# EAGLE schematic low-gain-radio (EAGLE 7.3.0)
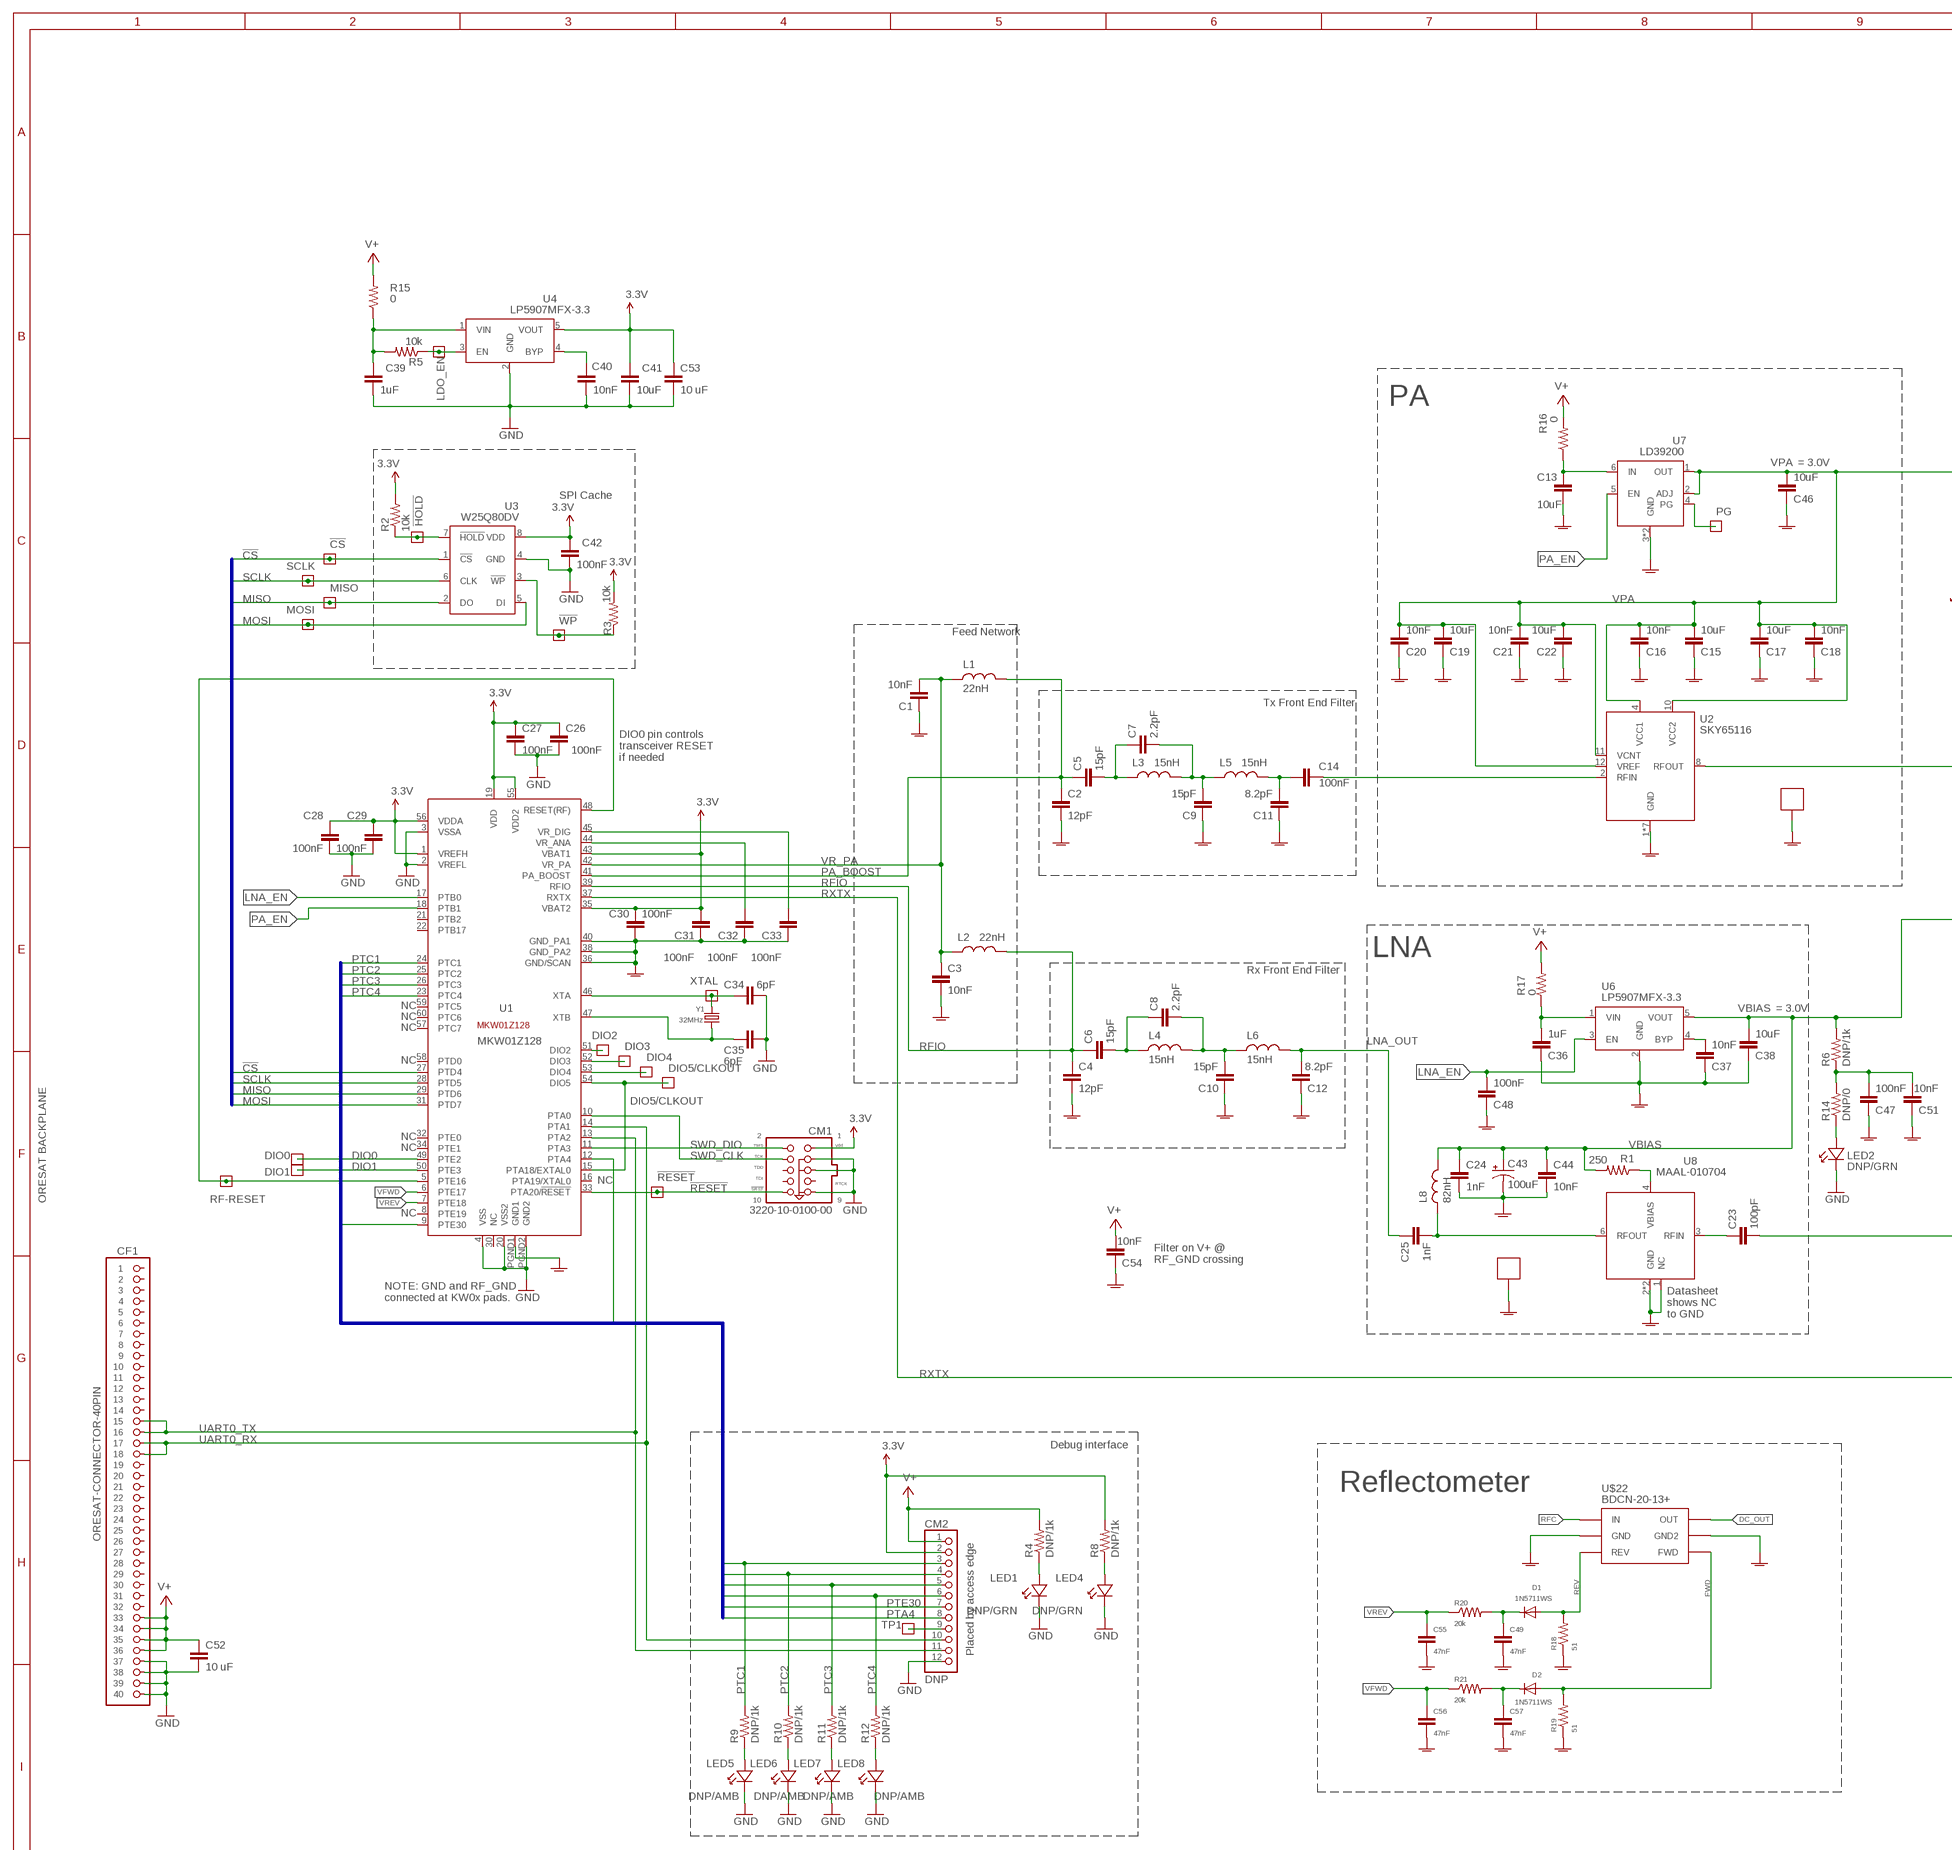
[diagram p0: schematic, sheet 1, part 1 of 2]
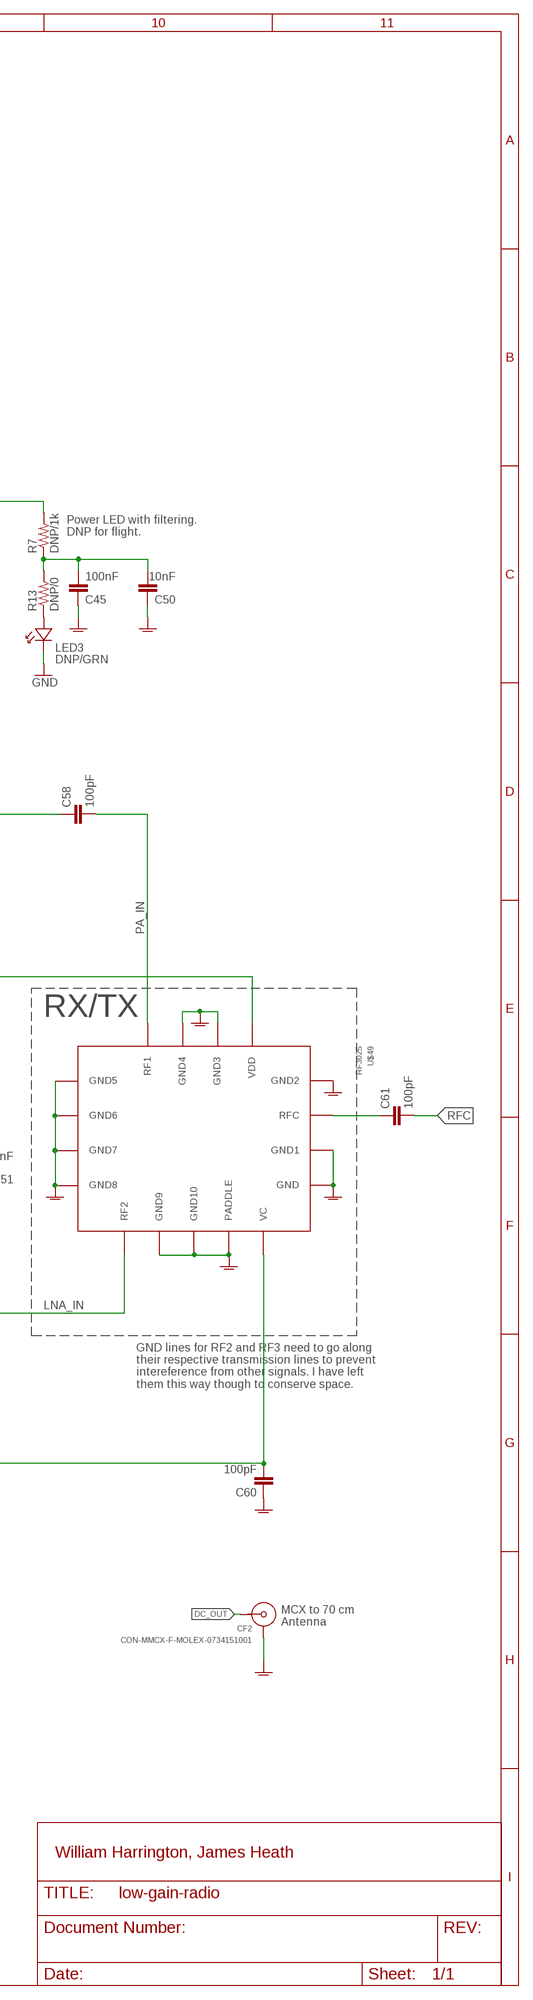
[diagram p1: schematic, sheet 1, part 2 of 2]

## Parts
!CS  TEST-POINT  [2MM-TEST-POINT]
!HOLD  TEST-POINT  [2MM-TEST-POINT]
!RESET  TEST-POINT  [2MM-TEST-POINT]
!WP  TEST-POINT  [2MM-TEST-POINT]
C1  10nF  C-EU0603-B-NOSILK  [.0603-B-NOSILK]
C2  12pF  C-EU0603-B-NOSILK  [.0603-B-NOSILK]
C3  10nF  C-EU0603-B-NOSILK  [.0603-B-NOSILK]
C4  12pF  C-EU0603-B-NOSILK  [.0603-B-NOSILK]
C5  15pF  C-EU0603-B-NOSILK  [.0603-B-NOSILK]
C6  15pF  C-EU0603-B-NOSILK  [.0603-B-NOSILK]
C7  2.2pF  C-EU0603-B-NOSILK  [.0603-B-NOSILK]
C8  2.2pF  C-EU0603-B-NOSILK  [.0603-B-NOSILK]
C9  15pF  C-EU0603-B-NOSILK  [.0603-B-NOSILK]
C10  15pF  C-EU0603-B-NOSILK  [.0603-B-NOSILK]
C11  8.2pF  C-EU0603-B-NOSILK  [.0603-B-NOSILK]
C12  8.2pF  C-EU0603-B-NOSILK  [.0603-B-NOSILK]
C13  10uF  C-EU0603-B-NOSILK  [.0603-B-NOSILK]
C14  100nF  C-EU0603-B-NOSILK  [.0603-B-NOSILK]
C15  10uF  C-EU0603-B-NOSILK  [.0603-B-NOSILK]
C16  10nF  C-EU0603-B-NOSILK  [.0603-B-NOSILK]
C17  10uF  C-EU0603-B-NOSILK  [.0603-B-NOSILK]
C18  10nF  C-EU0603-B-NOSILK  [.0603-B-NOSILK]
C19  10uF  C-EU0603-B-NOSILK  [.0603-B-NOSILK]
C20  10nF  C-EU0603-B-NOSILK  [.0603-B-NOSILK]
C21  10nF  C-EU0603-B-NOSILK  [.0603-B-NOSILK]
C22  10uF  C-EU0603-B-NOSILK  [.0603-B-NOSILK]
C23  100pF  C-EU0402-C-NOSILK  [.0402-C-NOSILK]
C24  1nF  C-EU0402-B-NOSILK  [.0402-B-NOSILK]
C25  1nF  C-EU0402-B-NOSILK  [.0402-B-NOSILK]
C26  100nF  C-EU0603-B-NOSILK  [.0603-B-NOSILK]
C27  100nF  C-EU0603-B-NOSILK  [.0603-B-NOSILK]
C28  100nF  C-EU0603-B-NOSILK  [.0603-B-NOSILK]
C29  100nF  C-EU0603-B-NOSILK  [.0603-B-NOSILK]
C30  100nF  C-EU0603-B-NOSILK  [.0603-B-NOSILK]
C31  100nF  C-EU0603-B-NOSILK  [.0603-B-NOSILK]
C32  100nF  C-EU0603-B-NOSILK  [.0603-B-NOSILK]
C33  100nF  C-EU0603-B-NOSILK  [.0603-B-NOSILK]
C34  6pF  C-EU0603-B-NOSILK  [.0603-B-NOSILK]
C35  6pF  C-EU0603-B-NOSILK  [.0603-B-NOSILK]
C36  1uF  C-EU0603-B-NOSILK  [.0603-B-NOSILK]
C37  10nF  C-EU0603-B-NOSILK  [.0603-B-NOSILK]
C38  10uF  C-EU0603-B-NOSILK  [.0603-B-NOSILK]
C39  1uF  C-EU0603-B-NOSILK  [.0603-B-NOSILK]
C40  10nF  C-EU0603-B-NOSILK  [.0603-B-NOSILK]
C41  10uF  C-EU0603-B-NOSILK  [.0603-B-NOSILK]
C42  100nF  C-EU0603-B-NOSILK  [.0603-B-NOSILK]
C43  100uF  CPOL-USCT6032  [CT6032]
C44  10nF  C-EU0402-B-NOSILK  [.0402-B-NOSILK]
C45  100nF  C-EU0603-B-NOSILK  [.0603-B-NOSILK]
C46  10uF  C-EU0603-B-NOSILK  [.0603-B-NOSILK]
C47  100nF  C-EU0603-B-NOSILK  [.0603-B-NOSILK]
C48  100nF  C-EU0603-B-NOSILK  [.0603-B-NOSILK]
C49  47nF  C-EU0402-C-NOSILK  [.0402-C-NOSILK]
C50  10nF  C-EU0402-B-NOSILK  [.0402-B-NOSILK]
C51  10nF  C-EU0402-B-NOSILK  [.0402-B-NOSILK]
C52  10 uF  C-EU0805-B-NOSILK  [.0805-B-NOSILK]
C53  10 uF  C-EU0805-B-NOSILK  [.0805-B-NOSILK]
C54  10nF  C-EU0402-B-NOSILK  [.0402-B-NOSILK]
C55  47nF  C-EU0402-C-NOSILK  [.0402-C-NOSILK]
C56  47nF  C-EU0402-C-NOSILK  [.0402-C-NOSILK]
C57  47nF  C-EU0402-C-NOSILK  [.0402-C-NOSILK]
C58  100pF  C-EU0402-C-NOSILK  [.0402-C-NOSILK]
C60  100pF  C-EU0402-C-NOSILK  [.0402-C-NOSILK]
C61  100pF  C-EU0402-C-NOSILK  [.0402-C-NOSILK]
CF1  ORESAT-CONNECTOR-40PIN  [HARWIN-ARCHER-M50-3202045]
CF2  CON-MMCX-F-MOLEX-0734151001  [CON-MMCX-F-MOLEX-0734151001]
CM1  3220-10-0100-00  JTAG_ARM-10-50MIL  [PINHEADER-2X5-0.05+POL+SILK]
CM2  DNP  PINHD-1X12  [1X12]
D1  1N5711WS  DIODESOD-323  [SOD-323]
D2  1N5711WS  DIODESOD-323  [SOD-323]
DIO0  TEST-POINT  [2MM-TEST-POINT]
DIO1  TEST-POINT  [2MM-TEST-POINT]
DIO2  TEST-POINT  [2MM-TEST-POINT]
DIO3  TEST-POINT  [2MM-TEST-POINT]
DIO4  TEST-POINT  [2MM-TEST-POINT]
DIO5/CLKOUT  TEST-POINT  [2MM-TEST-POINT]
L1  22nH  L-US0603-B-NOSILK  [.0603-B-NOSILK@1]
L2  22nH  L-US0603-B-NOSILK  [.0603-B-NOSILK@1]
L3  15nH  L-US0603-B-NOSILK  [.0603-B-NOSILK@1]
L4  15nH  L-US0603-B-NOSILK  [.0603-B-NOSILK@1]
L5  15nH  L-US0603-B-NOSILK  [.0603-B-NOSILK@1]
L6  15nH  L-US0603-B-NOSILK  [.0603-B-NOSILK@1]
L8  82nH  L-US0603-B-NOSILK  [.0603-B-NOSILK@1]
LDO_EN  TEST-POINT  [2MM-TEST-POINT]
LED1  DNP/GRN  LED-0603  [LED-0603]
LED2  DNP/GRN  LED-0603  [LED-0603]
LED3  DNP/GRN  LED-0603  [LED-0603]
LED4  DNP/GRN  LED-0603  [LED-0603]
LED5  DNP/AMB  LED-0603  [LED-0603]
LED6  DNP/AMB  LED-0603  [LED-0603]
LED7  DNP/AMB  LED-0603  [LED-0603]
LED8  DNP/AMB  LED-0603  [LED-0603]
MISO  TEST-POINT  [2MM-TEST-POINT]
MOSI  TEST-POINT  [2MM-TEST-POINT]
PG  TEST-POINT  [2MM-TEST-POINT]
R1  250  R-US_0603-B-NOSILK  [.0603-B-NOSILK@1]
R2  10k  R-US_0603-B-NOSILK  [.0603-B-NOSILK@1]
R3  10k  R-US_0603-B-NOSILK  [.0603-B-NOSILK@1]
R4  DNP/1k  R-US_0603-B-NOSILK  [.0603-B-NOSILK@1]
R5  10k  R-US_0603-B-NOSILK  [.0603-B-NOSILK@1]
R6  DNP/1k  R-US_0603-B-NOSILK  [.0603-B-NOSILK@1]
R7  DNP/1k  R-US_0603-B-NOSILK  [.0603-B-NOSILK@1]
R8  DNP/1k  R-US_0603-B-NOSILK  [.0603-B-NOSILK@1]
R9  DNP/1k  R-US_0603-B-NOSILK  [.0603-B-NOSILK@1]
R10  DNP/1k  R-US_0603-B-NOSILK  [.0603-B-NOSILK@1]
R11  DNP/1k  R-US_0603-B-NOSILK  [.0603-B-NOSILK@1]
R12  DNP/1k  R-US_0603-B-NOSILK  [.0603-B-NOSILK@1]
R13  DNP/0  R-US_0603-B-NOSILK  [.0603-B-NOSILK@1]
R14  DNP/0  R-US_0603-B-NOSILK  [.0603-B-NOSILK@1]
R15  0  R-US_0805-C-NOSILK  [.0805-C-NOSILK$1]
R16  0  R-US_0805-C-NOSILK  [.0805-C-NOSILK$1]
R17  0  R-US_0805-C-NOSILK  [.0805-C-NOSILK$1]
R18  51  R-US_0402-C-NOSILK  [.0402-C-NOSILK$1]
R19  51  R-US_0402-C-NOSILK  [.0402-C-NOSILK$1]
R20  20k  R-US_0402-C-NOSILK  [.0402-C-NOSILK$1]
R21  20k  R-US_0402-C-NOSILK  [.0402-C-NOSILK$1]
RF-RESET  TEST-POINT  [2MM-TEST-POINT]
SCLK  TEST-POINT  [2MM-TEST-POINT]
SH1  BMI-S-202-SHIELD  [BMI-S-202]
SH2  BMI-S-202-SHIELD  [BMI-S-202]
TP1  TEST-POINT  [2MM-TEST-POINT]
U1  MKW01Z128  [MKW01Z128]
U2  SKY65116  [SKY65116]
U3  W25Q80DV  [W25Q80DV]
U4  LP5907MFX-3.3  AAT3215  [SOT23-5]
U6  LP5907MFX-3.3  AAT3215  [SOT23-5]
U7  LD39200  [LD39200]
U8  MAAL-010704  [SOT-363]
U$22  BDCN-20-13+  [FV1206-1]
U$49  RF3025  [QFN-16_3MMX3MM]
XTAL  TEST-POINT  [2MM-TEST-POINT]
Y1  32MHz  CRYSTAL2.5X2.0MM  [CRYSTAL_2.5X2]

## Nets
3.3V: C26.1 C27.1 C28.2 C29.2 C30.2 C31.2 C41.2 C42.2 C53.1 CM1.1(VDD) CM2.2 R2.2 R3.2 R8.2 U1.1(VREFH) U1.19(VDD) U1.35(VBAT2) U1.43(VBAT1) U1.55(VDD2) U1.56(VDDA) U3.8(VDD) U4.5(VOUT)
!CS: !CS.1 U1.27(PTD4) U3.1(!CS)
!HOLD: !HOLD.1 R2.1 U3.7(!HOLD)
!RESET: !RESET.1 CM1.10(SRST) U1.33(PTA20/!RESET)
!WP: !WP.1 R3.1 U3.3(!WP)
BYPASS: C37.2 U6.4(BYP)
DC_OUT: CF2.CENTER U$22.OUT
DIO0: DIO0.1 U1.49(PTE2)
DIO1: DIO1.1 U1.50(PTE3)
DIO2: DIO2.1 U1.51(DIO2)
DIO3: DIO3.1 U1.52(DIO3)
DIO4: DIO4.1 U1.53(DIO4)
DIO5/CLKOUT: DIO5/CLKOUT.1 U1.15(PTA18/EXTAL0) U1.54(DIO5)
FWD: D2.A R19.2 U$22.FWD
GND: C26.2 C27.2 C28.1 C29.1 C34.1 C35.1 C39.1 C40.1 C41.1 C42.1 C52.2 C53.2 CF1.P$37 CF1.P$38 CF1.P$39 CF1.P$40 CM1.3(GND3) CM1.5(GND5) CM1.9(GND9) CM2.12 LED1.K LED2.K LED3.K LED4.K LED5.K LED6.K LED7.K LED8.K U1.2(VREFL) U1.3(VSSA) U1.4(VSS) U1.20(VSS2) U1.PGND2(GND2) U3.4(GND) U4.2(GND)
LDO_EN: LDO_EN.1 R5.1 U4.3(EN)
LNA_EN: C48.2 U1.17(PTB0) U6.3(EN)
LNA_IN [RF]: C23.2 U$49.RF2
LNA_OUT [RF]: C12.2 C25.1 L6.2
MISO: MISO.1 U1.29(PTD6) U3.2(DO)
MOSI: MOSI.1 U1.31(PTD7) U3.5(DI)
N$1: LED3.A R13.1
N$2: R1.1 U8.4(VBIAS)
N$3: LED2.A R14.1
N$4: PG.1 U7.4(PG)
N$5: CM2.9 TP1.1
N$6: C13.2 R16.1 U7.6(IN)
N$7 [RF]: C25.2 L8.1 U8.6(RFOUT)
N$8: C35.2 U1.47(XTB) Y1.3
N$9: C36.2 R17.1 U6.1(VIN)
N$10 [RF]: C5.2 C7.1 L3.1
N$12: C39.2 R5.2 R15.1 U4.1(VIN)
N$13: C40.2 U4.4(BYP)
N$14: LED1.A R4.1
N$15: LED5.A R9.1
N$16 [RF]: C7.2 C9.2 L3.2 L5.1
N$17 [RF]: C11.2 C14.2 L5.2
N$18 [RF]: C6.2 C8.1 L4.1
N$19 [RF]: C8.2 C10.2 L4.2 L6.1
N$20: LED6.A R10.1
N$21: LED7.A R11.1
N$22: LED4.A R8.1
N$23: LED8.A R12.1
N$24: C49.1 D1.C R20.2
N$25 [RF]: C23.1 U8.3(RFIN)
N$28: C57.1 D2.C R21.2
N$31: C32.2 U1.44(VR_ANA)
N$34: C33.2 U1.45(VR_DIG)
N$43 [RF]: C14.1 U2.2(RFIN)
PA_BOOST [RF]: C2.1 C5.1 L1.2 U1.41(PA_BOOST)
PA_EN: U1.18(PTB1) U7.5(EN)
PA_IN [RF]: C58.2 U$49.RF1
PTA4: CM2.8 U1.12(PTA4)
PTC1: CM2.3 R9.2 U1.24(PTC1)
PTC2: CM2.4 R10.2 U1.25(PTC2)
PTC3: CM2.5 R11.2 U1.26(PTC3)
PTC4: CM2.6 R12.2 U1.23(PTC4)
PTE30: CM2.7 U1.9(PTE30)
REV: D1.A R18.2 U$22.REV
RF_GND: C1.1 C2.2 C3.2 C4.2 C9.1 C10.1 C11.1 C12.1 C13.1 C15.1 C16.1 C17.1 C18.1 C19.1 C20.1 C21.1 C22.1 C24.2 C30.1 C31.1 C32.1 C33.1 C36.1 C37.1 C38.1 C43.- C44.2 C45.1 C46.1 C47.1 C48.1 C49.2 C50.1 C51.1 C54.1 C55.2 C56.2 C57.2 C60.1 CF2.G1(SHIELD) CF2.G2(SHIELD) CF2.G3(SHIELD) CF2.G4(SHIELD) R18.1 R19.1 SH1.P$1 SH1.P$2 SH1.P$3 SH1.P$4 SH1.P$5 SH1.P$6 SH1.P$7 SH1.P$8 SH1.P$9 SH1.P$10 SH1.P$11 SH1.P$12 SH2.P$1 SH2.P$2 SH2.P$3 SH2.P$4 SH2.P$5 SH2.P$6 SH2.P$7 SH2.P$8 SH2.P$9 SH2.P$10 SH2.P$11 SH2.P$12 U1.36(GND/SCAN) U1.38(GND_PA2) U1.40(GND_PA1) U1.PGND1(GND1) U2.1(GND) U2.3(GND) U2.5(GND) U2.6(GND) U2.7(GND) U2.9(GND) U2.CENTER(GND) U6.2(GND) U7.3(GND) U7.CENTER(GND) U8.1(NC) U8.2(GND) U8.5(GND) U$22.GND U$22.GND2 U$49.GND U$49.GND1 U$49.GND2 U$49.GND3 U$49.GND4 U$49.GND5 U$49.GND6 U$49.GND7 U$49.GND8 U$49.GND9 U$49.GND10 U$49.PADDLE
RF_RESET: RF-RESET.1 U1.5(PTE16) U1.48(RESET(RF))
RFC: C61.2 U$22.IN
RFIO [RF]: C4.1 C6.1 L2.2 U1.39(RFIO)
RFOUT [RF]: C58.1 U2.8(RFOUT)
RXTX: C60.2 U1.37(RXTX) U$49.VC
RXTX_OUT: C61.1 U$49.RFC
SCLK: SCLK.1 U1.28(PTD5) U3.6(CLK)
SWD_CLK: CM1.4(TCK) U1.10(PTA0)
SWD_DIO: CM1.2(TMS) U1.11(PTA3)
UART0_RX: CF1.P$17 CF1.P$18 CM2.10 U1.14(PTA1)
UART0_TX: CF1.P$15 CF1.P$16 CM2.11 U1.13(PTA2)
V+: C52.1 C54.2 CF1.P$33 CF1.P$34 CF1.P$35 CF1.P$36 CM2.1 R4.2 R15.2 R16.2 R17.2
V_LNA_FILTERED: C47.2 C51.2 R6.1 R14.2
V_PA_FILTERED: C45.2 C50.2 R7.1 R13.2
VBIAS: C24.1 C38.2 C43.+ C44.1 L8.2 R1.2 R6.2 U6.5(VOUT) U$49.VDD
VFWD: C56.1 R21.1 U1.6(PTE17)
VPA: C15.2 C16.2 C17.2 C18.2 C19.2 C20.2 C21.2 C22.2 C46.2 R7.2 U2.4(VCC1) U2.10(VCC2) U2.11(VCNT) U2.12(VREF) U7.1(OUT) U7.2(ADJ)
VR_PA: C1.2 C3.1 L1.1 L2.1 U1.42(VR_PA)
VREV: C55.1 R20.1 U1.7(PTE18)
XTA: C34.2 U1.46(XTA) XTAL.1 Y1.1
Unconnected: CF1.P$1 CF1.P$2 CF1.P$3 CF1.P$4 CF1.P$5 CF1.P$6 CF1.P$7 CF1.P$8 CF1.P$9 CF1.P$10 CF1.P$11 CF1.P$12 CF1.P$13 CF1.P$14 CF1.P$19 CF1.P$20 CF1.P$21 CF1.P$22 CF1.P$23 CF1.P$24 CF1.P$25 CF1.P$26 CF1.P$27 CF1.P$28 CF1.P$29 CF1.P$30 CF1.P$31 CF1.P$32 CM1.6(TDO) CM1.7(RTCK) CM1.8(TDI) U1.8(PTE19) U1.16(PTA19/XTAL0) U1.21(PTB2) U1.22(PTB17) U1.30(NC) U1.32(PTE0) U1.34(PTE1) U1.57(PTC7) U1.58(PTD0) U1.59(PTC5) U1.60(PTC6)

## Buses
PTA4,PTB2,PTB17,PTC[1..7],PTD0,PTE[16..19],PTE30
!HOLD,!CS,SCLK,MISO,MOSI,!WP

## Notes on the sheet
- PA
- = 3.0V
- SPI Cache
- Power LED with filtering.
  DNP for flight.
- Feed Network
- Tx Front End Filter
- DIO0 pin controls 
  transceiver RESET
  if needed
- LNA | RX/TX
- Rx Front End Filter
- NC | = 3.0V
- NC
- NC
- NC
- NC
- NC
- NC
- ORESAT BACKPLANE
- NC
- Filter on V+ @ 
  RF_GND crossing
- NOTE: GND and RF_GND 
  connected at KW0x pads.
- GND lines for RF2 and RF3 need to go along
  their respective transmission lines to prevent
  intereference from other signals. I have left
  them this way though to conserve space.
- Datasheet 
  shows NC
  to GND
- Debug interface
- Reflectometer
- MCX to 70 cm
  Antenna
- Placed by access edge
- William Harrington, James Heath

## Library data of the parts
!CS !HOLD !RESET !WP DIO0 DIO1-DIO4 DIO5/CLKOUT LDO_EN MISO MOSI PG RF-RESET SCLK TP1 XTAL = Tova:TEST-POINT
C1 C3 C16 C18 C20 C21 C37 C40 = rcl_custom:C-EU: CAPACITOR, European symbol; DIST: Digi-Key; DPN: 490-1512-2-ND; MFG: Murata; MFG_PN: GRM188R71H103KA01D
C2 C4 = rcl_custom:C-EU: CAPACITOR, European symbol; DIST: Digi-Key; DPN: 490-1405-2-ND; MFG: Murata; MFG_PN: GRM1885C1H120JA01D
C5 C6 C9 C10 = rcl_custom:C-EU: CAPACITOR, European symbol; DIST: Digi-Key; DPN: 490-1407-2-ND; MFG: Murata; MFG_PN: GRM1885C1H150JA01D
C7 C8 = rcl_custom:C-EU: CAPACITOR, European symbol; DIST: Digi-Key; DPN: 490-9668-2-ND; MFG: Murata; MFG_PN: GRM1885C1H2R2CA01D
C11 C12 = rcl_custom:C-EU: CAPACITOR, European symbol; DIST: Digi-Key; DPN: 06031U8R2BAT2A-ND; MFG: AVX; MFG_PN: 06031U8R2BAT2A
C13 C15 C17 C19 C22 C38 C41 C46 C53 = rcl_custom:C-EU: CAPACITOR, European symbol; DIST: Digi-Key; DPN: 490-6405-2-ND; MFG: Murata; MFG_PN: GRM188R60J106ME47J
C14 C26-C33 C42 C45 C47 C48 = rcl_custom:C-EU: CAPACITOR, European symbol; DIST: Digi-Key; DPN: 478-5778-1-ND; MFG: AVX; MFG_PN: 06035C104JAT2A
C23 C58 C60 C61 = low-gain-radio:C-EU: CAPACITOR, European symbol; DIST: Digi-Key Inc.; DPN: 399-11246-2-ND; MFG: Kemet; MPN: CBR04C101F3GAC
C24 C25 C50 C51 C54 = rcl_custom:C-EU: CAPACITOR, European symbol; DIST: Digi-key; DPN: 490-1303-1-ND; MFG: Murata; MFG_PN: GRM155R71H102KA01D
C34 C35 = rcl_custom:C-EU: CAPACITOR, European symbol; DIST: Digi-Key; DPN: GQM1875C2E6R0BB12D-ND; MFG: Murata; MFG_PN: GQM1875C2E6R0BB12D
C36 C39 = rcl_custom:C-EU: CAPACITOR, European symbol; DIST: Digi-Key; DPN: 490-1543-2-ND; MFG: Murata; MFG_PN: GRM188R61A105KA61D
C43 = rcl:CPOL-US: POLARIZED CAPACITOR, American symbol; DIST: Digi-Key; DPN: 478-1704-1-ND; MFG: AVX; MFG_PN: TAJC107K010RNJ
C44 = rcl_custom:C-EU: CAPACITOR, European symbol; DIST: Digi-key; DPN: 490-4516-1-ND; MFG: Murata; MFG_PN: GRM155R71H103KA88D
C49 C55-C57 = low-gain-radio:C-EU: CAPACITOR, European symbol; DIST: Digi-Key Inc.; DPN: 587-1068-1-ND; MFG: Taiyo Yuden; MPN: LMK105SD472KV-F
C52 = rcl_custom:C-EU: CAPACITOR, European symbol
CF1 = oresat-eagle:ORESAT-CONNECTOR-40PIN: OreSat 40pin card connector. Uses the Harwin Archer M50-3202045.
CF2 = oresat-eagle:CON-MMCX-F-MOLEX-0734151001: MMCX, Female, Through Hole, Right angle. Modeled after Molex 0734151001.
CM1 = low-gain-radio:JTAG_ARM-10-*: JTAG PIN HEADER 2x5 This is one of the (smaller) ARM standard JTAG connectors.; DIST: Digi-Key; DPN: 1175-1627-ND; MFG: CNC Tech; MFG_PN: 3220-10-0100-00
CM2 = pinhead:PINHD-1X12: PIN HEADER
D1 D2 = microbuilder:DIODE: Diode SMA Model Volts Amps Type Vf Vr Digikey # Notes SSA34-E3 40V 3A Schottky 480mV @ 3A 200uA @ 40V SSA34-E3/61TGITR-ND CDBA120-G 20V 1A Schottky 500mV @ 1A 500uA @ 20V 641-1014-6-ND REEL MBRA210 10V 2A Schottky 350mV @ 2A 700uA @ 10V MBRA210LT3 SOD-123 Model Volts Amps Type Vf Vr Order # Notes BAT54T1G 30V 200mA Schottky 800mV @ 200mA 2uA @ 25V BAT54T1GOSTR-ND B0530W 30V 500mA Schottky 430mV @ 500mA 130uA @ 30V B0530W-FDICT-ND REEL MBR120 1A 20V Schottky 340mV @ 1A MBR120VLSFT1GOSCT-ND SOD-323 Model Volts Amps Type Vf Vr Order # Notes PMEG2005EJ 20V 500mA Schottky 355mV @ 500mA 568-4110-1-ND ZLLS410 10V 570mA Schottky 380mV @ 570mA ZLLS410CT-ND 1N4148WS 75V 150mA Silicon/Simple 1V 1N4148WSFSCT-ND REEL SOD-523 Model Volts Amps Type Vf Vr Order # Notes BAT54XV2 30V 200mA Schottky 0.8V @ 100mA BAT54XV2CT-ND TB751S 30V 30mA Schottky RB751S-40TE61CT-ND SOT23-R/W (R = Solder Paste/Reflow Ovens, W = Hand-Soldering) Model Volts Amps Type Vf Vr Order # Notes BAT54FILM 40V 300mA Schottky 497-7162-1-ND; DIST: Digi-Key Inc.; DPN: 1N5711WS-FDICT-ND; MFG: Diodes Incorporated; MPN: 1N5711WS
L1 L2 = rcl_custom:L-US: INDUCTOR, American symbol; DIST: Digi-Key; DPN: 490-6874-1-ND; MFG: Murata; MFG_PN: LQW18AN22NG00D
L3-L6 = rcl_custom:L-US: INDUCTOR, American symbol; DIST: Digi-Key; DPN: 490-6866-1-ND; MFG: Murata; MFG_PN: LQW18AN15NG00D
L8 = rcl_custom:L-US: INDUCTOR, American symbol; DIST: Digi-Key; DPN: 490-6912-2-ND; MFG: Murata; MFG_PN: LQW18AN82NG00D
LED1-LED4 = psas_c3_team05:LED: Generic LED with Color designator as an attribute.; DIST: Digi-Key; DPN: 160-1446-1-ND; MFG: Lite-On Inc.; MFG_PN: LTST-C191KGKT
LED5-LED8 = psas_c3_team05:LED: Generic LED with Color designator as an attribute.; DIST: Digi-Key; DPN: 160-1440-1-ND; MFG: Lite-On Inc.; MFG_PN: LTST-C191AKT
R1 = rcl_custom:R-US_: RESISTOR, American symbol; DIST: Digi-Key; DPN: 1276-4592-2-ND; MFG: Samsung; MFG_PN: RC1608F2490CS
R2 R3 R5 = rcl_custom:R-US_: RESISTOR, American symbol; DIST: Digi-Key; DPN: 311-10.0KHRCT-ND; MFG: Yageo; MFG_PN: RC0603FR-0710KL
R4 R6-R12 = rcl_custom:R-US_: RESISTOR, American symbol; DIST: Digi-Key; DPN: 311-1.00KHRCT-ND; MFG: Yageo; MFG_PN: RC0603FR-071KL
R13 R14 = rcl_custom:R-US_: RESISTOR, American symbol; DIST: Digi-Key; DPN: 311-0.0GRTR-ND; MFG: Yageo; MFG_PN: RC0603JR-070RL
R15-R17 = low-gain-radio:R-US_: RESISTOR, American symbol; DIST: Digi-Key Inc.; DPN: 311-0.0ARCT-ND; MFG: Yageo; MPN: RC0805JR-070RL
R18 R19 = low-gain-radio:R-US_: RESISTOR, American symbol; DIST: Digi-Key Inc.; DPN: 311-51.0LRCT-ND; MFG: Yageo; MPN: RC0402FR-0751RL
R20 R21 = low-gain-radio:R-US_: RESISTOR, American symbol; DIST: Digi-Key Inc.; DPN: YAG1389CT-ND; MFG: Yageo; MPN: RT0402BRD0721KL
SH1 SH2 = hw-laird-bmi-s-202:BMI-S-202-SHIELD
U1 = psas_c3_team05:MKW01Z128; DIST: Digi-Key; DPN: MKW01Z128CHN-ND; MFN: NXP; MPN: MKW01Z128CHN
U2 = psas_c3_team05:SKY65116: SKYWORK SKY65116 LINEAR POWER AMPLIFIER
U3 = psas_c3_team05:W25Q80DV; DIST: Digi-Key; DPN: W25Q80DVSSIG-ND; MFG: Winbond Electronics; MFG_PN: W25Q80DVSSIG
U4 U6 = psas_c3_team05:AAT3215; DIST: Digi-Key; DPN: 296-38557-1-ND; MFN: Texas Instruments; MFN-PN: LP5907MFX-3.3
U7 = psas_c3_team05:LD39200; DIST: Digi-Key; DPN: 497-15229-2-ND; MFG: STMicroelectronics; MFG_PN: LD39200PU33R
U8 = psas_c3_team05:MAAL-010704: MACOM MAAL-010704 Low Noise Amplifier
U$22 = low-gain-radio:BDCN-20-13+; MFG: Mini-Circuits; MPN: BDCN-20-13+
U$49 = low-gain-radio:RF3025; DIST: Digi-Key Inc.; DPN: 689-1087-1-ND; MFG: RFMD; MPN: RF3025TR7
Y1 = microbuilder:CRYSTAL: Crystals HC49UP - Surface Mount Crystal 4.0MHz 18pF +/-30ppm Surface Mount Crystal [Digikey: 535-9857-1-ND] 12.0 MHz Surface Mount Crystal [Digikey: 535-9869-6-ND] 25.0 MHz Surface Mount Crystal [Digikey: 535-9078-1-ND] 2.5 x 2.0mm - MEMs SMT Crystal 16.0 MHz 10pF 20ppm 2.5 x 2.0mm Crystal [Digikey -40-85°C: 535-10923-1-ND] 3.2 x 2.5mm - MEMs SMT Crystal 12.0 MHz 8pF 15ppm 3.2 x 2.5mm Crystal [Digikey: -10-70°C: 644-1047-1-ND -40-125°C: 644-1128-1-ND] 16.0 MHz 8pF 15ppm 3.2 x 2.5mm Crystal [Digikey: -10-70°C: 644-1049-1-ND -40-125°C: 644-1129-2-ND] 16.0 MHz 10pF 10ppm 3.2 x 2.5mm Crystal [Digikey: 644-1100-1-ND] 27.12 MHz 18pF 30ppm 3.2 x 2.5mm Crystal [Digikey: 887-1424-1-ND] 27.12MHz 10pF 10ppm 3.2 x 2.5mm Crystal [Digikey: 887-1329-1-ND] 4.9 x 1.8mm - MEMs SMT Crystal 32.768 KHz 12.5pF 20ppm 4.9 x 1.8mm Crystal [Digikey: SE2415CT-ND] 8.0 x 3.8mm - Surface Mount Crystal 32.768kHz 12.5pF 20ppm -40°C-85°C [Digikey: 535-9166-2-ND] Cylinder 32.768KHz Cylinder Crystal (2x6mm body) [Ex. Digikey: 300-8341-2-ND]; DIST: Digi-Key; DPN: SER4044CT-ND; MFN: EPSON; MPN: FA20H 32.0000MF12Y-W3

## Net classes
1 RF: width 0.343 mm, clearance 0.4 mm